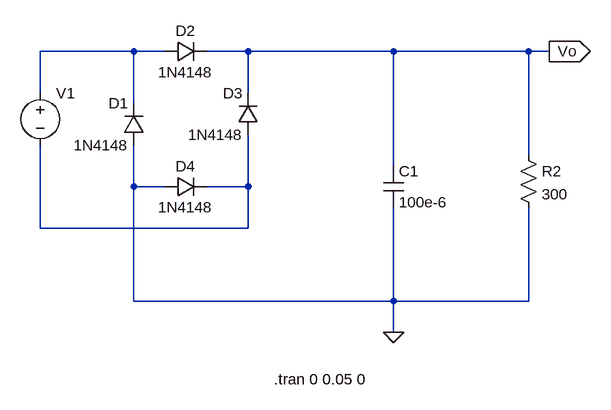
[diagram p0: schematic DC_PowerSupply.asc]
DC_PowerSupply.asc, the LTspice schematic file:
Version 4
SHEET 1 920 680
WIRE 192 32 48 32
WIRE 240 32 192 32
WIRE 368 32 304 32
WIRE 592 32 368 32
WIRE 800 32 592 32
WIRE 832 32 800 32
WIRE 48 96 48 32
WIRE 368 96 368 32
WIRE 192 112 192 32
WIRE 800 192 800 32
WIRE 592 208 592 32
WIRE 192 240 192 176
WIRE 240 240 192 240
WIRE 368 240 368 160
WIRE 368 240 304 240
WIRE 48 304 48 176
WIRE 368 304 368 240
WIRE 368 304 48 304
WIRE 192 416 192 240
WIRE 592 416 592 272
WIRE 592 416 192 416
WIRE 800 416 800 272
WIRE 800 416 592 416
WIRE 592 464 592 416
FLAG 592 464 0
FLAG 832 32 Vo
IOPIN 832 32 Out
SYMBOL voltage 48 80 R0
WINDOW 3 24 96 Invisible 2
WINDOW 123 0 0 Left 0
WINDOW 39 0 0 Left 0
WINDOW 0 54 16 Right 2
SYMATTR Value SINE(0 4.7 1000)
SYMATTR InstName V1
SYMBOL diode 208 176 R180
WINDOW 0 24 64 Left 2
WINDOW 3 24 0 Left 2
SYMATTR InstName D1
SYMATTR Value 1N4148
SYMBOL diode 240 48 R270
WINDOW 0 32 32 VTop 2
WINDOW 3 0 32 VBottom 2
SYMATTR InstName D2
SYMATTR Value 1N4148
SYMBOL diode 384 160 R180
WINDOW 0 24 64 Left 2
WINDOW 3 24 0 Left 2
SYMATTR InstName D3
SYMATTR Value 1N4148
SYMBOL diode 240 256 R270
WINDOW 0 32 32 VTop 2
WINDOW 3 0 32 VBottom 2
SYMATTR InstName D4
SYMATTR Value 1N4148
SYMBOL cap 576 208 R0
SYMATTR InstName C1
SYMATTR Value 100e-6
SYMBOL res 784 176 R0
SYMATTR InstName R2
SYMATTR Value 300
TEXT 408 536 Left 2 !.tran 0 0.05 0

The netlist it stands for:
* DC_PowerSupply.asc
V1 N001 N002 SINE(0 4.7 1000)
D1 0 N001 1N4148
D2 N001 Vo 1N4148
D3 N002 Vo 1N4148
D4 0 N002 1N4148
C1 Vo 0 100e-6
R2 Vo 0 300
.model D D
.lib standard.dio
.tran 0 0.05 0
.backanno
.end